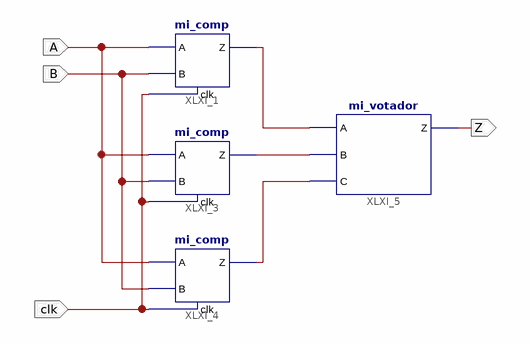
[diagram p0: schematic sheet 1]
// Xilinx ISE schematic sch_main.sch (artix7) as structural Verilog: 4 symbols, 4 ports
module sch_main (
  input  A,
  input  B,
  input  clk,
  output Z
);

  wire XLXN_1, XLXN_2, XLXN_3;

  mi_comp XLXI_1 (.A(A), .B(B), .Z(XLXN_3), .clk(clk));
  mi_comp XLXI_3 (.A(A), .B(B), .Z(XLXN_2), .clk(clk));
  mi_comp XLXI_4 (.A(A), .B(B), .Z(XLXN_1), .clk(clk));
  mi_votador XLXI_5 (.A(XLXN_3), .B(XLXN_2), .C(XLXN_1), .Z(Z));
endmodule
